# Altium schematic sheet P04 Power.SchDoc
size 246 x 182 mm
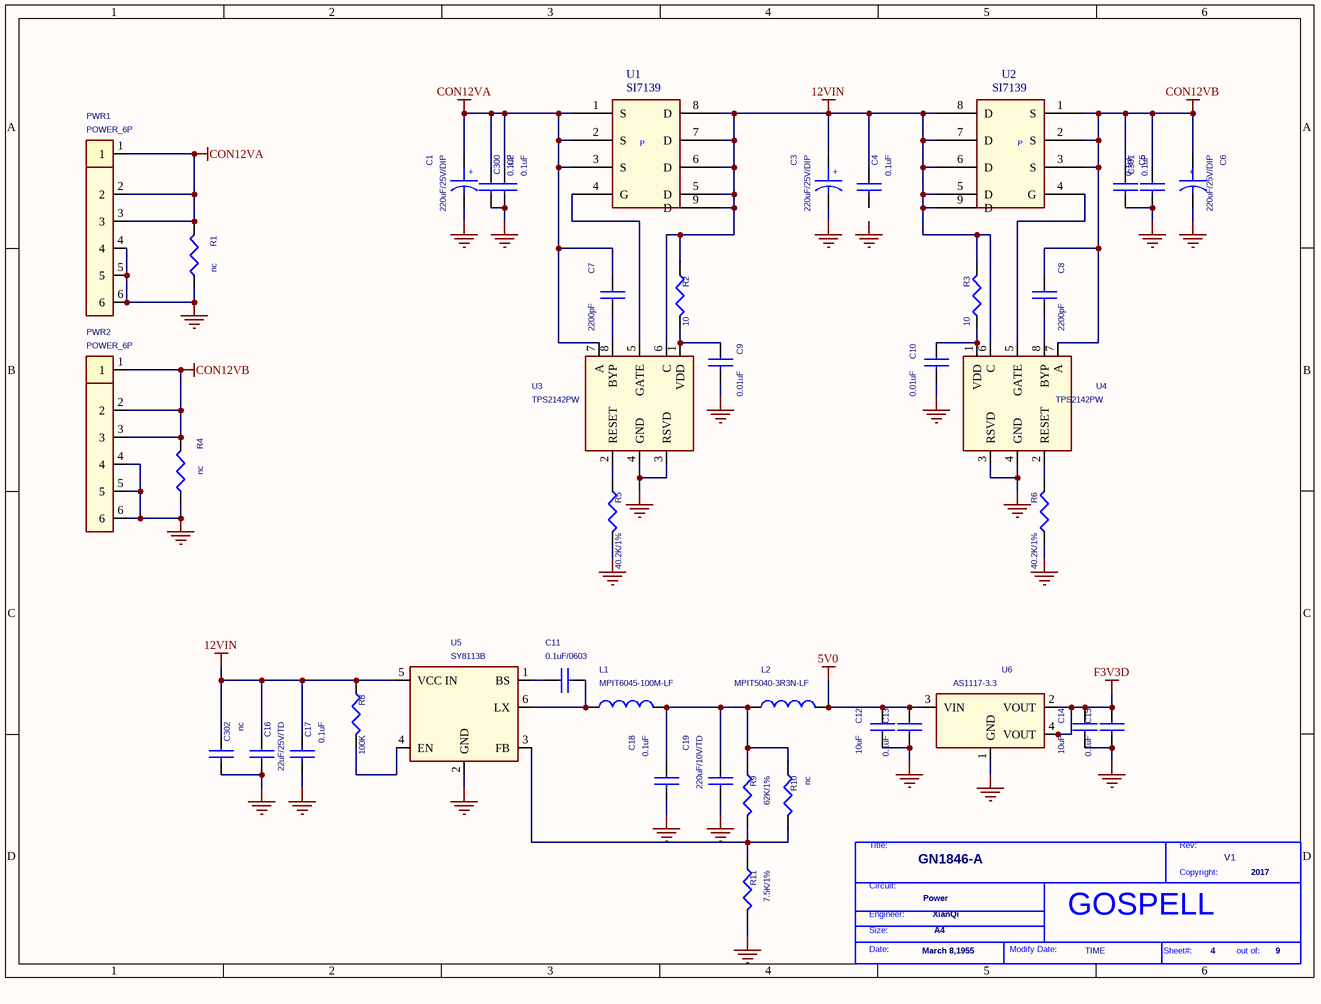
[diagram p0: P04 Power.SchDoc]

## Parts
*  Doc: Power  Page Count: 9  Page Number: 4  Page Create Date: March 8,1955  Page Size: A4  RevCode: V1  Title: GN1846-A  Copyright: 2017  Engineer: XianQi  Page Modify Date: TIME  (hidden comment: GOSPELL)  (graphical)
C1  220uF/25V/DIP  [CE8X3.5]
C2  0.1uF  [0402C]
C3  220uF/25V/DIP  [CE8X3.5]
C4  0.1uF  [0402C]
C5  0.1uF  [0402C]
C6  220uF/25V/DIP  [CE8X3.5]
C7  2200pF  [0402C]
C8  2200pF  [0402C]
C9  0.01uF  [0402C]
C10  0.01uF  [0402C]
C11  0.1uF/0603  [0402C]
C12  10uF  [C0603]
C13  0.1uF  [0402C]
C14  10uF  [C0603]
C15  0.1uF  [0402C]
C16  22uF/25V/TD  [C6032]
C17  0.1uF  [0402C]
C18  0.1uF  [0402C]
C19  220uF/10V/TD  [C6032]
C300  0.1uF  [C1206]
C301  0.1uF  [C1206]
C302  nc  [C1206]
L1  MPIT6045-100M-LF  [MPI6045]
L2  MPIT5040-3R3N-LF  [FB0805]
PWR1  POWER_6P  [TJC2-6]
PWR2  POWER_6P  [TJC2-6]
R1  nc  [0805]
R2  10  [R0603]
R3  10  [R0603]
R4  nc  [0805]
R5  40.2K/1%  [0402R]
R6  40.2K/1%  [0402R]
R8  100K  [0402R]
R9  62K/1%  [0402R]
R10  nc  [0402R]
R11  7.5K/1%  [0402R]
U1  SI7139  [PowerPAKSO8]
U2  SI7139  [PowerPAKSO8]
U3  TPS2142PW  [TSSOP-8]
U4  TPS2142PW  [TSSOP-8]
U5  SY8113B  [SOT23_6_G]
U6  AS1117-3.3  [SOT223]

## Nets
5V0: C12.1 C13.1 L2.2 U6.3(VIN)
12VIN: C3.1 C4.1 C16.1 C17.1 C302.1 R2.1 R3.1 R8.1 U1.5(D) U1.6(D) U1.7(D) U1.8(D) U1.9(D) U2.5(D) U2.6(D) U2.7(D) U2.8(D) U2.9(D) U3.6(C) U4.6(C) U5.5(VCC_IN)
CON12VA: C1.1 C2.1 C7.1 C300.1 PWR1.1 PWR1.2 PWR1.3 R1.1 U1.1(S) U1.2(S) U1.3(S) U3.7(A)
CON12VB: C5.1 C6.1 C8.1 C301.1 PWR2.1 PWR2.2 PWR2.3 R4.1 U2.1(S) U2.2(S) U2.3(S) U4.7(A)
F3V3D: C14.1 C15.1 U6.2(VOUT) U6.4(VOUT)
GND: C1.2 C2.2 C3.2 C5.2 C6.2 C9.2 C10.2 C12.2 C13.2 C14.2 C15.2 C16.2 C17.2 C18.2 C19.2 C300.2 C301.2 C302.2 PWR1.4 PWR1.5 PWR1.6 PWR2.4 PWR2.5 PWR2.6 R1.2 R4.2 R5.2 R6.2 R11.2 U3.3(RSVD) U3.4(GND) U4.3(RSVD) U4.4(GND) U5.2(GND) U6.1(GND)
NetC7_2: C7.2 U3.8(BYP)
NetC8_2: C8.2 U4.8(BYP)
NetC9_1: C9.1 R2.2 U3.1(VDD)
NetC10_1: C10.1 R3.2 U4.1(VDD)
NetC11_1: C11.1 U5.1(BS)
NetC11_2: C11.2 L1.1 U5.6(LX)
NetC18_1: C18.1 C19.1 L1.2 L2.1 R9.1 R10.1
NetR5_1: R5.1 U3.2(RESET)
NetR6_1: R6.1 U4.2(RESET)
NetR8_2: R8.2 U5.4(EN)
NetR9_2: R9.2 R10.2 R11.1 U5.3(FB)
NetU1_4: U1.4(G) U3.5(GATE)
NetU2_4: U2.4(G) U4.5(GATE)

Not connected (* = marked no-connect by the designer): C4 2

## Notes on the sheet
- Labels drawn without touching a wire or pin: GND
- (in symbol CAP POL) +
- (in symbol GOSPELL) Title:; Rev:; Copyright:; Circuit:; Engineer:; Size:; Date:; Modify Date:; Sheet#:; out of:
- (in symbol SI7139) P

## Library data of the parts
C1 C3 C6 = CAP POL
C2 C4 C5 C7-C11 C16-C19 C300-C302 = CAP NP
C12-C15 = CAP NP_Dup1
L1 L2 = CHOKE TORROID_0
PWR1 PWR2 = POWER_4P
R1-R6 R8-R11 = R
U5 = SY8120
U6 = AS1117-X_0
* = GOSPELL: Cage Code: 2017; Schematic Page Count: 9; Schematic Page Number: 4